# EAGLE design plug in boards (EAGLE 9.2.2)
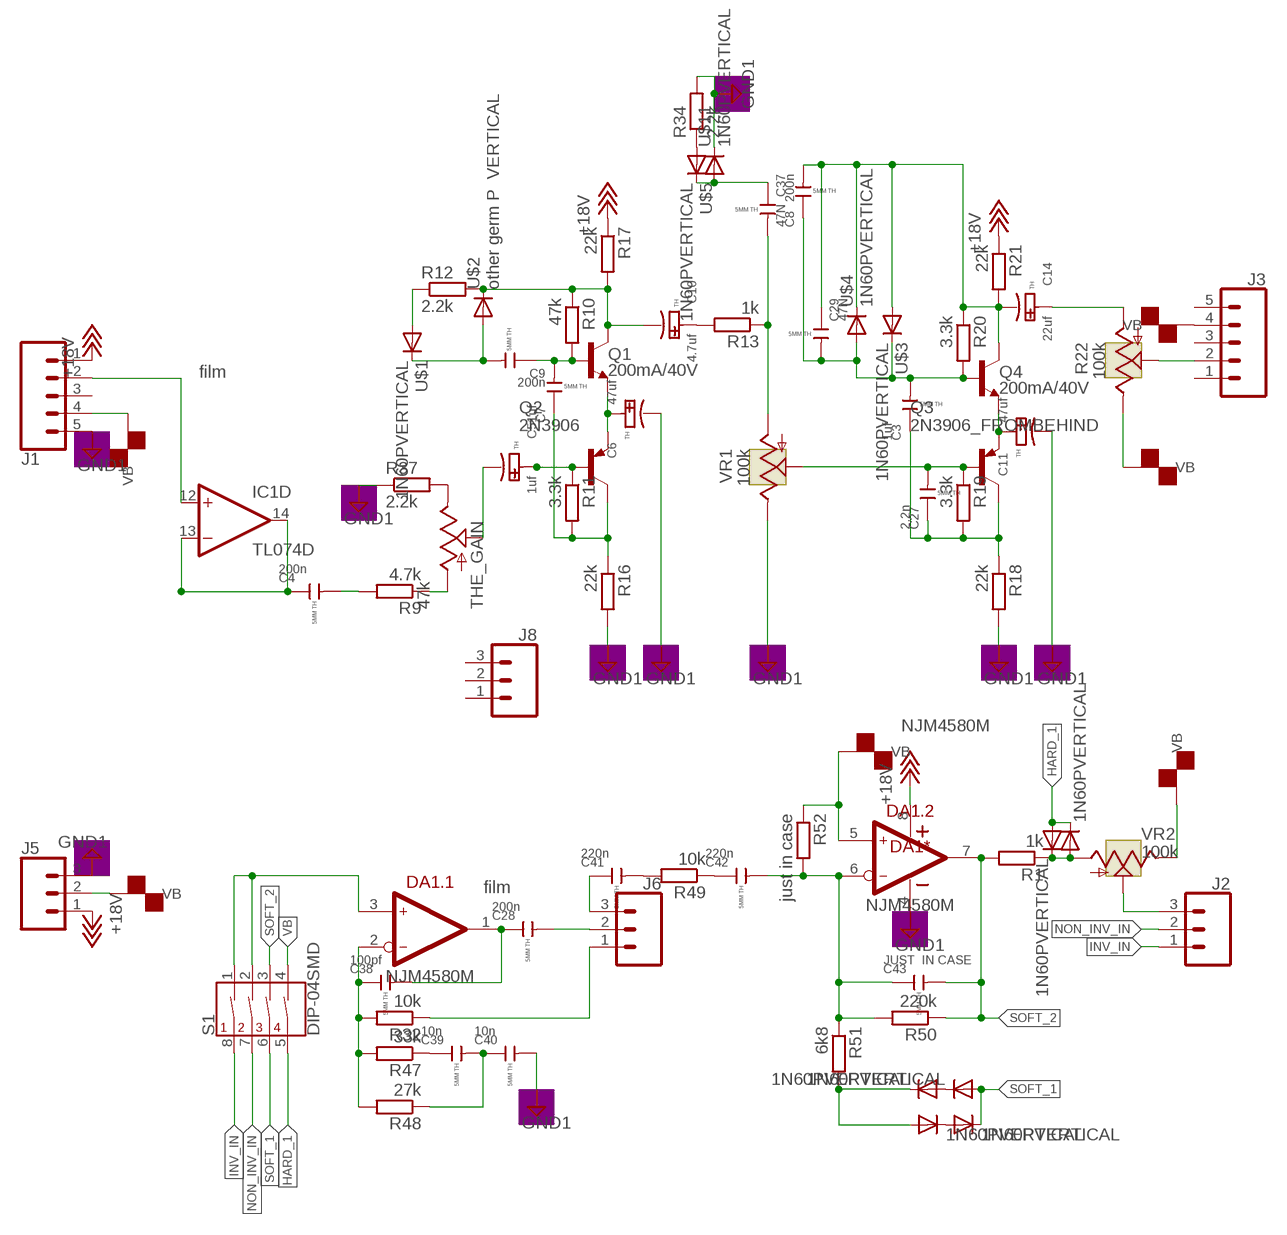
[diagram p0: schematic, sheet 1]

## Parts
C3  1uf  THRU_HOLE_5MM_SPACING  [CERAMIC-5MM]
C4  200n  THRU_HOLE_5MM_SPACING  [CERAMIC-5MM]
C5  1uf  THRU-HOLE-POLARIZED  [PC-D5.3MM]
C6  47uf  THRU-HOLE-POLARIZED  [PC-D5.3MM]
C7  1uf  THRU_HOLE_5MM_SPACING  [CERAMIC-5MM]
C8  47N  THRU_HOLE_5MM_SPACING  [CERAMIC-5MM]
C9  200n  THRU_HOLE_5MM_SPACING  [CERAMIC-5MM]
C10  4.7uf  THRU-HOLE-POLARIZED  [PC-D5.3MM]
C11  47uf  THRU-HOLE-POLARIZED  [PC-D5.3MM]
C14  22uf  THRU-HOLE-POLARIZED  [PC-D5.3MM]
C27  2.2n  THRU_HOLE_5MM_SPACING  [CERAMIC-5MM]
C28  200n  THRU_HOLE_5MM_SPACING  [CERAMIC-5MM]
C29  47N  THRU_HOLE_5MM_SPACING  [CERAMIC-5MM]
C37  200n  THRU_HOLE_5MM_SPACING  [CERAMIC-5MM]
C38  100pf  THRU_HOLE_5MM_SPACING  [CERAMIC-5MM]
C39  10n  THRU_HOLE_5MM_SPACING  [CERAMIC-5MM]
C40  10n  THRU_HOLE_5MM_SPACING  [CERAMIC-5MM]
C41  220n  THRU_HOLE_5MM_SPACING  [CERAMIC-5MM]
C42  220n  THRU_HOLE_5MM_SPACING  [CERAMIC-5MM]
C43  JUST IN CASE  THRU_HOLE_5MM_SPACING  [CERAMIC-5MM]
DA1  NJM4580M  [SO-8]
IC1  TL074D  [SO14]
J1  CONN_05PTH_LONGPADS  [1X05_LONGPADS]
J2  CONN_03LONGPADS  [1X03_LONGPADS]
J3  CONN_05PTH_LONGPADS  [1X05_LONGPADS]
J5  CONN_03LONGPADS  [1X03_LONGPADS]
J6  CONN_03LONGPADS  [1X03_LONGPADS]
J8  CONN_03LONGPADS  [1X03_LONGPADS]
Q1  200mA/40V  TRANS_NPN-2N3904  [TO-92]
Q2  2N3906  [TO92]
Q3  2N3906_FROMBEHIND  2N3906  [TO92]
Q4  200mA/40V  TRANS_NPN-2N3904  [TO-92]
R1  1k  R-EU_R1206  [R1206]
R9  4.7k  R-EU_R1206  [R1206]
R10  47k  R-EU_R1206  [R1206]
R11  3.3k  R-EU_R1206  [R1206]
R12  2.2k  R-EU_R1206  [R1206]
R13  1k  R-EU_R1206  [R1206]
R16  22k  R-EU_R1206  [R1206]
R17  22k  R-EU_R1206  [R1206]
R18  22k  R-EU_R1206  [R1206]
R19  3.3k  R-EU_R1206  [R1206]
R20  3.3k  R-EU_R1206  [R1206]
R21  22k  R-EU_R1206  [R1206]
R22  100k  TRIM_US-3223G  [3223G]
R32  10k  R-EU_R1206  [R1206]
R34  2.2k  R-EU_R1206  [R1206]
R37  2.2k  R-EU_R1206  [R1206]
R47  33k  R-EU_R1206  [R1206]
R48  27k  R-EU_R1206  [R1206]
R49  10k  R-EU_R1206  [R1206]
R50  220k  R-EU_R1206  [R1206]
R51  6k8  R-EU_R1206  [R1206]
R52  just in case  R-EU_R1206  [R1206]
S1  DIP-04SMD  [DIPSWITCH-04-SMD]
THE_GAIN  47k  POT  [ALPS_POT]
U$1  1N60PVERTICAL  [DO41-1]
U$2  other germ P VERTICAL  1N60PVERTICAL  [DO41-1]
U$3  1N60PVERTICAL  [DO41-1]
U$4  1N60PVERTICAL  [DO41-1]
U$5  1N60PVERTICAL  [DO41-1]
U$9  1N60PVERTICAL  [DO41-1]
U$11  1N60PVERTICAL  [DO41-1]
U$12  1N60PVERTICAL  [DO41-1]
U$26  1N60PVERTICAL  [DO41-1]
U$27  1N60PVERTICAL  [DO41-1]
U$28  1N60PVERTICAL  [DO41-1]
U$29  1N60PVERTICAL  [DO41-1]
VR1  100k  TRIM_US-3223G  [3223G]
VR2  100k  TRIM_US-3223G  [3223G]

## Nets
+18V: DA1.8(*:V+) J1.1 J5.1 R17.1 R21.1
GND1: C6.- C11.- C40.2 DA1.4(*:V-) J1.5 J5.3 R16.2 R18.2 R34.2 R37.1 U$11.C VR1.3(E)
HARD_1: S1.5(4B) U$9.A U$12.C
INV_IN: J2.1 S1.8(1B)
N$1: R12.1 U$1.A
N$2: C14.+ R22.1(A)
N$3: C28.2 J6.2
N$4: C9.2 U$1.C U$2.A
N$5: C41.1 J6.3
N$6: C4.2 R9.2
N$7: R1.1 U$9.C U$12.A VR2.1(A)
N$8: IC1.12(D:+IN) J1.2
N$10: C4.1 IC1.13(D:-IN) IC1.14(D:OUT)
N$12: R9.1 THE_GAIN.P$3(A)
N$13: C5.- THE_GAIN.P$2(S)
N$14: C5.+ Q2.2(B) R11.1
N$15: C6.+ Q1.1(E) Q2.3(E)
N$16: C7.2 C9.1 Q1.2(B) R10.2
N$17: R37.2 THE_GAIN.P$1(E)
N$18: C7.1 Q2.1(C) R11.2 R16.1
N$19: C37.2 R13.1 VR1.1(A)
N$23: C10.- Q1.3(C) R10.1 R12.2 R17.2 U$2.C
N$25: C11.+ Q3.3(E) Q4.1(E)
N$26: C10.+ R13.2
N$27: J3.2 R22.2(S)
N$28: C3.1 C27.1 Q3.1(C) R18.1 R19.2
N$29: C27.2 Q3.2(B) R19.1 VR1.2(S)
N$44: J2.3 VR2.2(S)
N$45: J6.1 R32.1
N$46: C39.1 R47.1
N$47: C39.2 C40.1 R48.1
N$51: C3.2 C8.1 C29.2 Q4.2(B) R20.2 U$3.C U$4.A
N$52: R34.1 U$5.A
N$55: C37.1 U$5.C U$11.A
N$61: C41.2 R49.2
N$63: C8.2 C14.- C29.1 Q4.3(C) R20.1 R21.2 U$3.A U$4.C
N$64: C42.1 R49.1
N$66: C28.1 C38.2 DA1.1(.1:OUT)
N$67: C42.2 C43.1 DA1.6(.2:IN-) R50.2 R51.1 R52.2
N$69: U$26.C U$27.A
N$70: U$28.C U$29.A
N$71: R51.2 U$27.C U$28.A
N$72: C38.1 DA1.2(.1:IN-) R32.2 R47.2 R48.2
N$73: DA1.3(.1:IN+) S1.1(1A) S1.2(2A)
NON_INV_IN: J2.2 S1.7(2B)
SOFT_1: S1.6(3B) U$26.A U$29.C
SOFT_2: C43.2 DA1.7(.2:OUT) R1.2 R50.1 S1.3(3A)
VB: DA1.5(.2:IN+) J1.4 J3.4 J5.2 R22.3(E) R52.1 S1.4(4A) VR2.3(E)
Unconnected: IC1.1(A:OUT) IC1.2(A:-IN) IC1.3(A:+IN) IC1.5(B:+IN) IC1.6(B:-IN) IC1.7(B:OUT) IC1.8(C:OUT) IC1.9(C:-IN) IC1.10(C:+IN) J1.3 J3.1 J3.3 J3.5 J8.1 J8.2 J8.3

## Notes on the sheet
- film
- film

## Power pins joined to a net without a drawn wire
V+: IC1.4(P:V+)
V-: IC1.11(P:V-)

## Library data of the parts
C3 C4 C7-C9 C27-C29 C37-C43 = GT_Capacitor:THRU_HOLE_5MM_SPACING: 302010202; PACKAGE: 5MM TH
C5 C6 C10 C11 C14 = GT_Capacitor:THRU-HOLE-POLARIZED: 302030033; PACKAGE: TH
DA1 = ic-jrc:NJM4580; MOUSER: 513-NJM4580M
IC1 = linear:TL074: OP AMP
J1 J3 = GT_Connectors:CONN_05: Multi connection point. Often used as Generic Header-pin footprint for 0.1 inch spaced/style header connections On any of the 0.1 inch spaced packages, you can populate with these: Break Away Headers - Straight <https://www.sparkfun.com/products/116> (PRT-00116) Break Away Male Headers - Right Angle <https://www.sparkfun.com/products/553> (PRT-00553) Female Headers <https://www.sparkfun.com/products/115> (PRT-00115) Break Away Headers - Machine Pin <https://www.sparkfun.com/products/117> (PRT-00117) Break Away Female Headers - Swiss Machine Pin <https://www.sparkfun.com/products/743> (PRT-00743) For SCREWTERMINALS and SPRING TERMINALS visit here: Screw Terimnals on SparkFun.com <https://www.sparkfun.com/search/results?term=Screw+Terminals> (5mm/3.5mm/2.54mm spacing) This device is also useful as a general connection point to wire up your design to another part of your project. Our various solder wires solder well into these plated through hole pads. Hook-Up Wire - Assortment (Stranded, 22 AWG) <https://www.sparkfun.com/products/11375> (PRT-11375) Hook-Up Wire - Assortment (Solid Core, 22 AWG) <https://www.sparkfun.com/products/11367> (PRT-11367) View the entire wire category on our website here <https://www.sparkfun.com/categories/141> Special notes: Molex polarized connector foot print use with SKU : PRT-08231 with associated crimp pins and housings. 1MM SMD Version SKU: PRT-10208
J2 J5 J6 J8 = GT_Connectors:CONN_03: Multi connection point. Often used as Generic Header-pin footprint for 0.1 inch spaced/style header connections On any of the 0.1 inch spaced packages, you can populate with these: Break Away Headers - Straight <https://www.sparkfun.com/products/116> (PRT-00116) Break Away Male Headers - Right Angle <https://www.sparkfun.com/products/553> (PRT-00553) Female Headers <https://www.sparkfun.com/products/115> (PRT-00115) Break Away Headers - Machine Pin <https://www.sparkfun.com/products/117> (PRT-00117) Break Away Female Headers - Swiss Machine Pin <https://www.sparkfun.com/products/743> (PRT-00743) Stackable Header - 3 Pin (Female, 0.1") <https://www.sparkfun.com/products/13875> (PRT-13875) For SCREWTERMINALS and SPRING TERMINALS visit here: Screw Terimnals on SparkFun.com <https://www.sparkfun.com/search/results?term=Screw+Terminals> (5mm/3.5mm/2.54mm spacing) This device is also useful as a general connection point to wire up your design to another part of your project. Our various solder wires solder well into these plated through hole pads. Hook-Up Wire - Assortment (Stranded, 22 AWG) <https://www.sparkfun.com/products/11375> (PRT-11375) Hook-Up Wire - Assortment (Solid Core, 22 AWG) <https://www.sparkfun.com/products/11367> (PRT-11367) View the entire wire category on our website here <https://www.sparkfun.com/categories/141> Special notes: Molex polarized connector foot print use with SKU : PRT-08232 with associated crimp pins and housings.
Q1 Q4 = SparkFun-DiscreteSemi:TRANS_NPN: NPN transistor Current controlled devices typically used to amplify current or used as a switch. BC547 - COM-08928 <http://www.sparkfun.com/products/8928> (TO-92 45V 100mA) (1.Collector 2.Base 3.Emitter) 2N3904 - COM-00521 <http://www.sparkfun.com/products/521> (TO-92 40V 200mA) (1.Emitter 2.Base 3.Collector) P2N2222A - COM-12852 <http://www.sparkfun.com/products/12852> (TO-92 40V 600mA) (1.Collector 2.Base 3.Emitter); PROD_ID: TRANS-08447
Q2 = transistor-pnp:2N3906: PNP Transistor
Q3 = GOLD_transistor-pnp:2N3906: PNP Transistor
R1 R9-R13 R16-R21 R32 R34 R37 R47-R52 = resistor:R-EU_: RESISTOR, European symbol
R22 VR1 VR2 = pot:TRIM_US-: POTENTIOMETER
S1 = SparkFun-Switches:DIP-04: 4-Position DIP Switch 4-circuit DIP (dual inline package) switch. Commonly used to physcially set a circuit's behavior. SparkFun Products Prototype Part; PROD_ID: SWCH-12418
THE_GAIN = SparkFun-Electromechanical:POT
U$1-U$5 U$9 U$11 U$12 U$26-U$29 = diode:1N60P

## Board
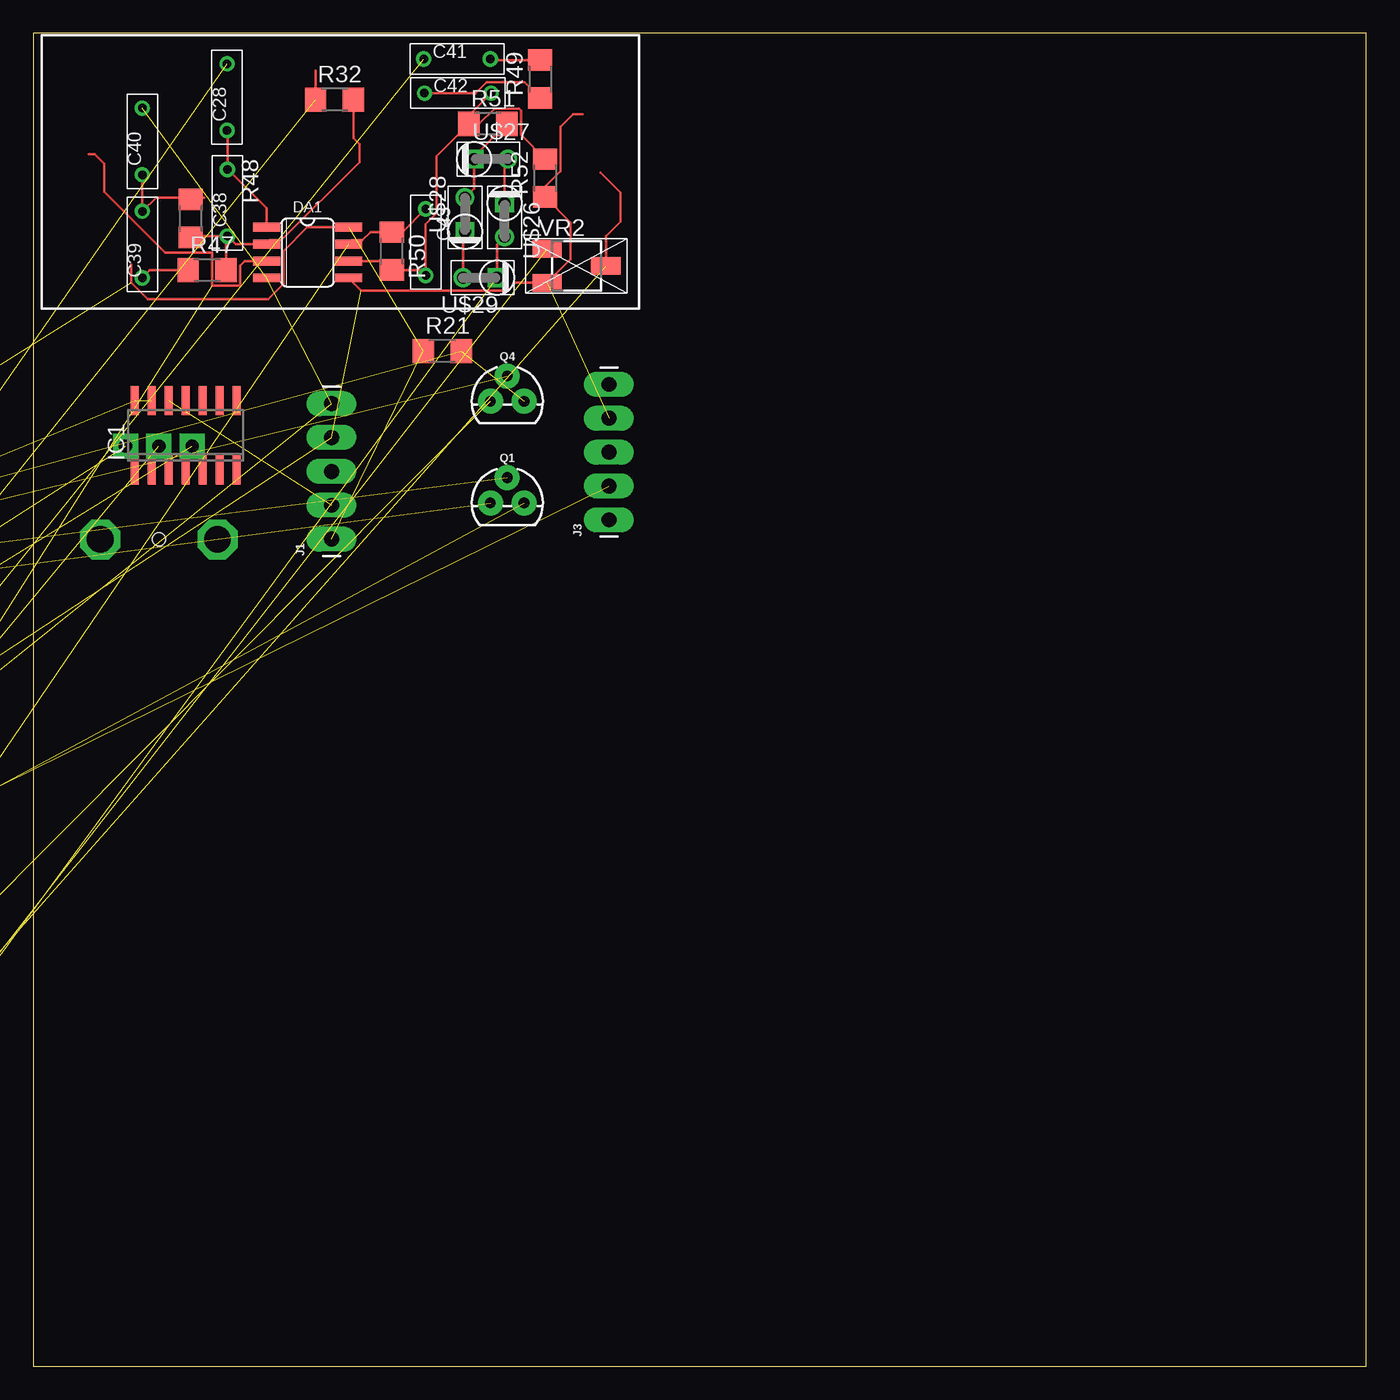
[diagram p1: board, top side]
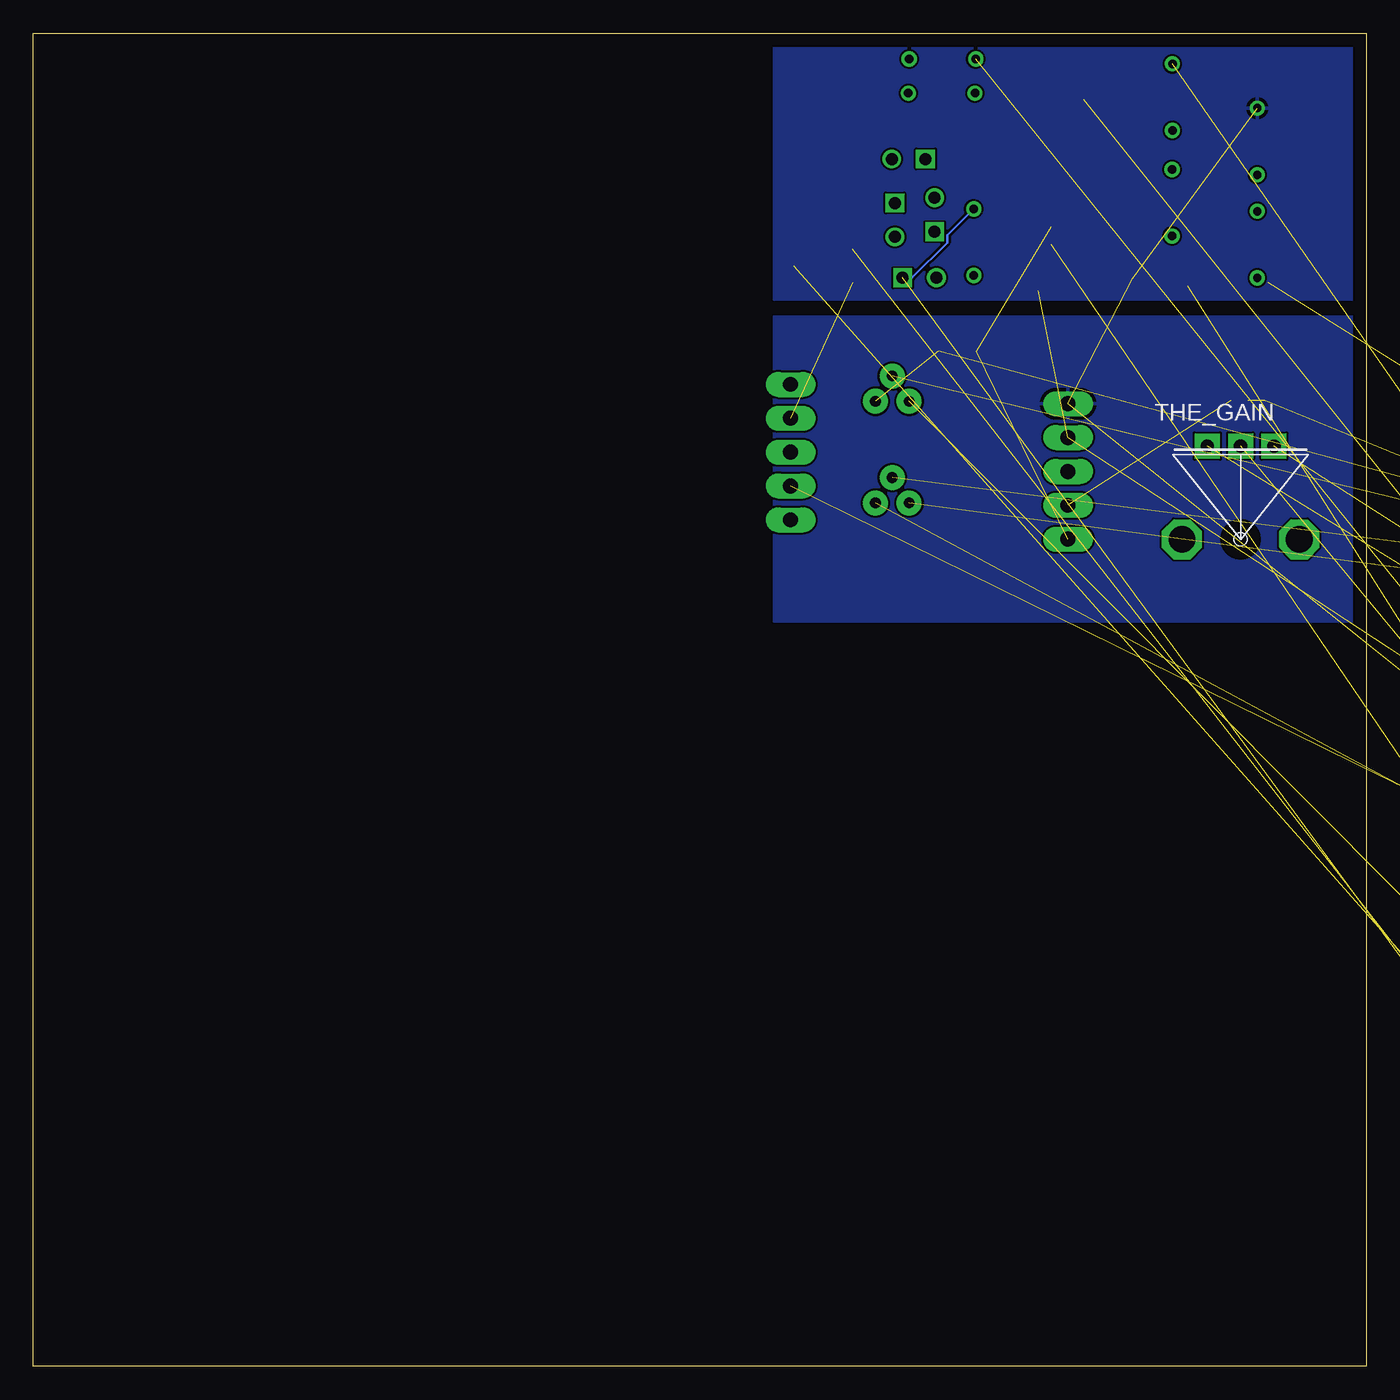
[diagram p2: board, bottom side, seen from below]

Size 100 x 100 mm. Coordinates in mm from the lower left corner, seen from the top.
Outline: 0,0 100,0 100,100 0,100 0,0
Copper layers (1*16): Top 0.035mm / dielectric 1.5mm / Bottom 0.035mm
Design rules "default": minimum track width 6mil, minimum drill 0.35mm, track to track 6mil, track to pad 6mil, pad to pad 6mil, via to via 6mil, smd to smd 6mil, copper to edge 40mil, drill to drill 6mil, minimum pad ring 10mil, minimum via ring 8mil, stop-mask expansion 4mil, vias tented up to drill 0mil, thermal gap 10mil

### Footprints (pad centres in the part's own frame; a part is rotated, then mirrored left to right if it is on the bottom)
CERAMIC-5MM = drill 0.635 pad 1.143: 1 -2.5,0; 2 2.5,0
PC-D5.3MM = drill 0.8 pad 1.35 square: + -1,0 | drill 0.8 pad 1.35: - 1,0
SO-8 = smd 0.66 x 2.032: 1 -1.905,-3.073; 2 -0.635,-3.073; 3 0.635,-3.073; 4 1.905,-3.073; 5 1.905,3.073; 6 0.635,3.073; 7 -0.635,3.073; 8 -1.905,3.073
SO14 = smd 0.6 x 2.2: 1 -3.81,-2.6; 2 -2.54,-2.6; 3 -1.27,-2.6; 4 0,-2.6; 5 1.27,-2.6; 6 2.54,-2.6; 7 3.81,-2.6; 8 3.81,2.6; 9 2.54,2.6; 10 1.27,2.6; 11 0,2.6; 12 -1.27,2.6; 13 -2.54,2.6; 14 -3.81,2.6
1X05_LONGPADS = drill 1.118 pad 1.88 long: 1 0,0; 2 2.54,0; 3 5.08,0; 4 7.62,0; 5 10.16,0
1X03_LONGPADS = drill 1.118 pad 1.88 long: 1 0,0; 2 2.54,0; 3 5.08,0
TO-92 = drill 0.813 pad 1.88: 1 -1.27,0; 2 0,1.905; 3 1.27,0
TO92 = drill 0.813 octagon: 1 1.27,0; 2 0,1.905; 3 -1.27,0
TO92' = drill 0.813 octagon: 1 2.54,0; 2 0,0; 3 -2.54,0
R1206 = smd 1.6 x 1.803: 1 -1.422,0; 2 1.422,0
3223G = smd 2.184 x 1.321: 1 -2.2,1.273; 2 2.2,0; 3 -2.2,-1.273
DIPSWITCH-04-SMD = smd 1.27 x 2.54: 1 -3.81,4.445; 2 -1.27,4.445; 3 1.27,4.445; 4 3.81,4.445; 5 3.81,-4.445; 6 1.27,-4.445; 7 -1.27,-4.445; 8 -3.81,-4.445
ALPS_POT = drill 1 pad 1.88 square: P$1 7,-2.5; P$2 7,0; P$3 7,2.5 | drill 2 octagon: P$4 0,-4.4; P$5 0,4.4 | hole 1: 0,0
DO41-1 = drill 0.9: A 1.27,0 | drill 0.9 square: C -1.27,0

### Placement (x,y rotation side)
C3  -16.51,58.42 0 top  (outside the outline)
C4  -24.13,58.42 0 top  (outside the outline)
C5  -44.45,5.08 0 top  (outside the outline)
C6  -52.07,5.08 0 top  (outside the outline)
C7  -31.75,58.42 0 top  (outside the outline)
C8  -39.37,58.42 0 top  (outside the outline)
C9  -46.99,58.42 0 top  (outside the outline)
C10  -59.69,5.08 0 top  (outside the outline)
C11  -16.51,20.32 0 top  (outside the outline)
C14  -24.13,20.32 0 top  (outside the outline)
C27  -54.61,58.42 0 top  (outside the outline)
C28  14.54,95.21 90 top
C29  -16.51,62.23 0 top  (outside the outline)
C37  -24.13,62.23 0 top  (outside the outline)
C38  14.57,87.29 90 top
C39  8.17,84.15 90 top
C40  8.17,91.89 90 top
C41  31.79,98.07 0 top
C42  31.85,95.51 0 top
C43  29.44,84.33 90 top
DA1  20.57,83.55 270 top
IC1  11.43,69.85 0 top
J1  22.37,62.05 90 top
J2  -64,-32.64 0 top  (outside the outline)
J3  43.18,63.5 90 top
J5  -64,-4.48 0 top  (outside the outline)
J6  -64,-11.52 0 top  (outside the outline)
J8  -64,-25.6 0 top  (outside the outline)
Q1  35.56,64.77 0 top
Q2  -50.8,53.34 0 top  (outside the outline)
Q3  2N3906_FROMBEHIND  [TO92']  -36.83,53.34 0 top  (outside the outline)
Q4  35.56,72.39 0 top
R1  -64.64,-50.56 0 top  (outside the outline)
R9  -55.88,27.94 0 top  (outside the outline)
R10  -46.99,36.83 0 top  (outside the outline)
R11  -62.23,27.94 0 top  (outside the outline)
R12  -16.51,36.83 0 top  (outside the outline)
R13  -52.07,36.83 0 top  (outside the outline)
R16  -57.15,36.83 0 top  (outside the outline)
R17  -62.23,36.83 0 top  (outside the outline)
R18  -15.24,43.18 0 top  (outside the outline)
R19  -22.86,36.83 0 top  (outside the outline)
R20  -29.21,36.83 0 top  (outside the outline)
R21  30.68,76.16 0 top
R22  -54.61,19.05 0 top  (outside the outline)
R32  22.6,95.02 0 top
R34  -35.56,36.83 0 top  (outside the outline)
R37  -41.91,36.83 0 top  (outside the outline)
R47  13.04,82.22 0 top
R48  11.82,86.12 270 top
R49  38.03,96.57 90 top
R50  26.9,83.66 270 top
R51  34.1,93.2 0 top
R52  38.4,89.14 90 top
S1  -60.16,-41.6 0 top  (outside the outline)
THE_GAIN  9.42,62.03 90 top
U$1  -27.94,48.26 0 top  (outside the outline)
U$2  -33.02,48.26 0 top  (outside the outline)
U$3  -38.1,48.26 0 top  (outside the outline)
U$4  -43.18,48.26 0 top  (outside the outline)
U$5  -48.26,48.26 0 top  (outside the outline)
U$9  -64.64,-56.96 0 top  (outside the outline)
U$11  -22.86,48.26 0 top  (outside the outline)
U$12  -64.64,-62.08 0 top  (outside the outline)
U$26  35.36,86 270 top
U$27  34.33,90.57 0 top
U$28  32.38,86.39 90 top
U$29  33.51,81.66 180 top
VR1  -63.5,19.05 0 top  (outside the outline)
VR2  40.75,82.55 0 top

### Tracks (layer width: path | path; a pad name or v marks a point on that pad's centre or on a via)
+18V  (4 unrouted)
  Top 0.203: 7.34,82.66 7.34,81.31 8.58,80.07 17.63,80.07 18.77,81.21 18.77,83.67 20.55,85.45 DA1.8
GND1  (11 unrouted)
  pour Bottom: 0,100.33 44.45,100.33 44.45,80.01 0,80.01
  pour Bottom: 0,78.74 44.45,78.74 44.45,55.88 0,55.88
HARD_1  (2 unrouted)
INV_IN  (1 unrouted)
N$1  (1 unrouted)
N$2  (1 unrouted)
N$3  (1 unrouted)
N$4  (2 unrouted)
N$5  (1 unrouted)
N$6  (1 unrouted)
N$7  (3 unrouted)
N$8  (1 unrouted)
N$10  (2 unrouted)
N$12  (1 unrouted)
N$13  (1 unrouted)
N$14  (2 unrouted)
N$15  (2 unrouted)
N$16  (3 unrouted)
N$17  (1 unrouted)
N$18  (3 unrouted)
N$19  (2 unrouted)
N$23  (5 unrouted)
N$25  (2 unrouted)
N$26  (1 unrouted)
N$27  (1 unrouted)
N$28  (4 unrouted)
N$29  (3 unrouted)
N$44  (1 unrouted)
  Top 0.203: VR2.2 42.95,84.77 44.04,85.87 44.04,88.05 42.55,89.54
N$45  (1 unrouted)
  Top 0.203: R32.1 21.18,97.18
N$46
  Top 0.203: R47.1 8.74,82.22 C39.1
N$47
  Top 0.203: C40.1 C39.2 9.2,87.68 11.96,87.68 | 12.8,87.68 11.96,87.68 | 11.96,87.68 R48.1
N$51  (6 unrouted)
N$52  (1 unrouted)
N$55  (2 unrouted)
N$61
  Top 0.203: R49.2 34.37,97.99 C41.2
N$63  (7 unrouted)
N$64
  Top 0.203: C42.1 33.18,95.51 34.01,96.33 36.84,96.33 R49.1
N$66
  Top 0.203: DA1.1 17.5,86.86 C38.2 14.57,92.68 C28.1
N$67
  Top 0.203: DA1.6 26.22,82.92 R50.2 29.03,82.24 C43.1 29.44,85.66 30.27,86.49 30.27,90.79 R51.1 | R51.1 32.68,93.84 C42.2 | R52.2 36.58,92.39 36.58,94.21 36.43,94.36 34.62,94.36 33.46,93.2 R51.1
N$69
  Top 0.203: U$26.C 35.36,90.33 U$27.A
N$70
  Top 0.203: U$29.A 32.24,84.98 U$28.C
N$71
  Top 0.203: U$28.A 33.06,88.34 U$27.C 33.06,90.74 R51.2
N$72
  Top 0.203: R47.2 14.46,84.68 C38.1 | C38.1 11.91,84.79 R48.2 | C38.1 15.18,84.19 DA1.2 17.78,84.46 18.61,84.46 24.48,90.33 24.48,91.67 24.02,92.13 R32.2
N$73  (2 unrouted)
  Top 0.203: DA1.3 15.84,82.92 15.52,82.59 15.52,81.06 13.41,81.06 13.41,83.56 9.88,83.56 5.3,88.14 5.3,90.22 4.6,90.92 4.16,90.92
NON_INV_IN  (1 unrouted)
SOFT_1  (1 unrouted)
  Top 0.203: U$26.A 34.78,84.15 U$29.C
SOFT_2  (2 unrouted)
  Top 0.203: C43.2 27.69,85.08 R50.1 25.29,85.08 24.68,84.46 23.92,84.46 DA1.7
  Bottom 0.203: C43.2 31.42,84.85 31.42,84.31 34.07,81.66
VB  (5 unrouted)
  Top 0.203: DA1.5 24.59,80.7 35.59,80.7 36.16,81.28 VR2.3 40.32,83.05 40.32,85.8 38.42,87.7 | 38.42,87.7 R52.1 | 38.42,87.7 38.42,88.52 39.56,89.66 39.56,92.99 40.48,93.91 41.2,93.91